# Altium schematic sheet Power.SchDoc
size 420 x 297 mm; SheetNumber: 3; SheetTotal: 11
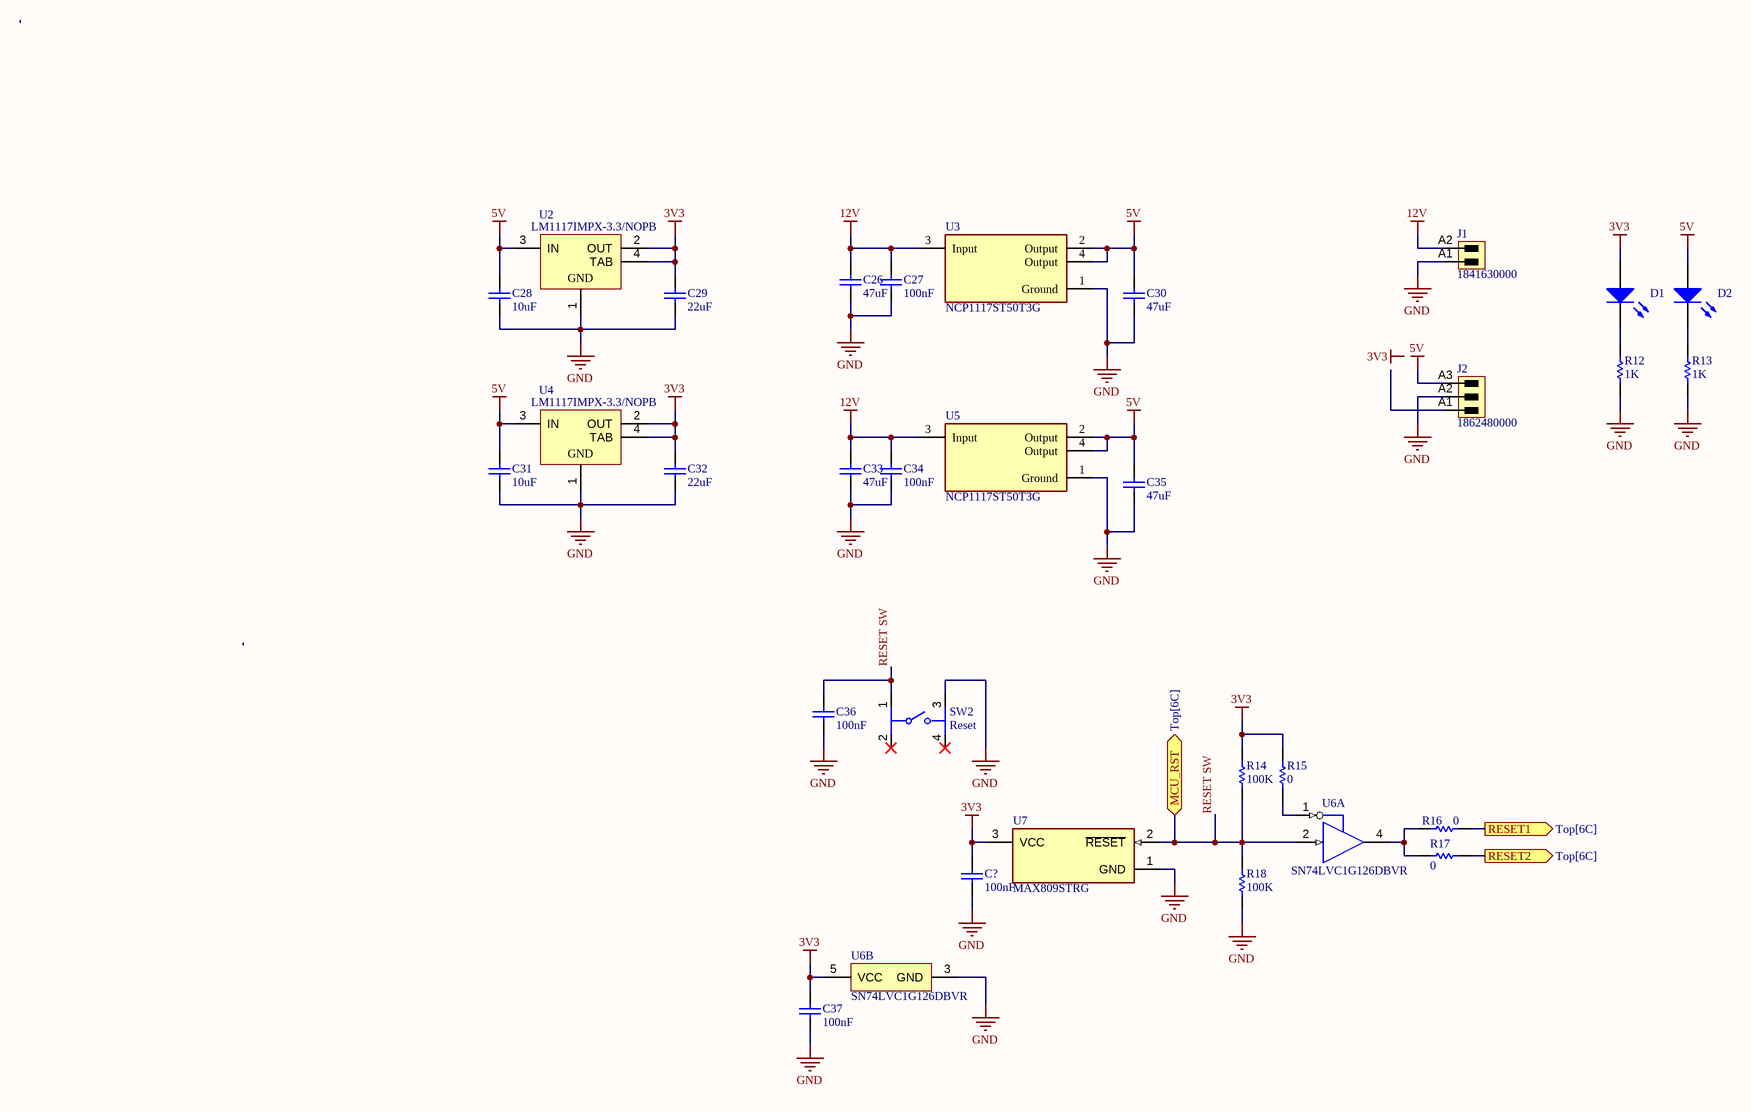
[diagram p0: Power.SchDoc]

## Parts
C26  value 47uF  (hidden comment: Capacitor)
C27  value 100nF  (hidden comment: Capacitor)
C28  value 10uF  (hidden comment: Capacitor)
C29  value 22uF  (hidden comment: Capacitor)
C30  value 47uF  (hidden comment: Capacitor)
C31  value 10uF  (hidden comment: Capacitor)
C32  value 22uF  (hidden comment: Capacitor)
C33  value 47uF  (hidden comment: Capacitor)
C34  value 100nF  (hidden comment: Capacitor)
C35  value 47uF  (hidden comment: Capacitor)
C36  value 100nF  (hidden comment: Capacitor)
C37  value 100nF  (hidden comment: Capacitor)
C?  value 100nF  (hidden comment: Capacitor)
D1  Light-Emitting Diode  (value not drawn)
D2  Light-Emitting Diode  (value not drawn)
J1  1841630000  [SL_SMT_3_5_90G_02]
J2  1862480000  [SC_SMT_3_81_90G_03]
R12  value 1K  (hidden comment: Resistor)
R13  value 1K  (hidden comment: Resistor)
R14  value 100K  (hidden comment: Resistor)
R15  value 0  (hidden comment: Resistor)
R16  value 0  (hidden comment: Resistor)
R17  value 0  (hidden comment: Resistor)
R18  value 100K  (hidden comment: Resistor)
SW2  Reset  [FP-PTS526SK15SMTR2LFS-MFG]
U2  LM1117IMPX-3.3/NOPB  [MP04A_M]
U3  NCP1117ST50T3G  [FP-318H-MFG]
U4  LM1117IMPX-3.3/NOPB  [MP04A_M]
U5  NCP1117ST50T3G  [FP-318H-MFG]
U6  SN74LVC1G126DBVR  [DBV0005A_L]  (parts A,B of 2)
U7  MAX809STRG  [FP-318-08-MFG]

## Ports
MCU_RST (bidir, see Top[6C]), RESET1 (out, see Top[6C]), RESET2 (out, see Top[6C])

## Nets
3V3: C29.2 C32.2 C37.1 C?.1 D1.1(A) R14.1 R15.1 U2.2(OUT) U2.4(TAB) U4.2(OUT) U4.4(TAB) U6.5(VCC) U7.3(VCC)
5V: C28.2 C30.2 C31.2 C35.2 D2.1(A) J2.A3 U2.3(IN) U3.2(Output) U3.4(Output) U4.3(IN) U5.2(Output) U5.4(Output)
12V: C26.2 C27.2 C33.2 C34.2 J1.A2 U3.3(Input) U5.3(Input)
GND: C26.1 C27.1 C28.1 C29.1 C30.1 C31.1 C32.1 C33.1 C34.1 C35.1 C36.2 C37.2 C?.2 J1.A1 J2.A2 R12.2 R13.2 R18.2 SW2.3 U2.1(GND) U3.1(Ground) U4.1(GND) U5.1(Ground) U6.3(GND) U7.1(GND)
RESET1: R16.1 ; port RESET1
RESET2: R17.2 ; port RESET2
RESET SW: C36.1 R14.2 R18.1 SW2.1 U6.2(A) U7.2(~{RESET}) ; port MCU_RST
NetD1_2: D1.2(K) R12.1
NetD2_2: D2.2(K) R13.1
NetR15_2: R15.2 U6.1(OE)
NetR16_2: R16.2 R17.1 U6.4(Y)

Not connected (* = marked no-connect by the designer): J2 A1; SW2 2* 4*

## Notes on the sheet
- Labels drawn without touching a wire or pin: 3V3
- THIS DOCUMENT AND THE DATA DISCLOSED HEREIN OR
- HEREWITH IS THE PROPERTY OF ALTIUM LIMITED AND MAY
- DWG NO:
- REVISION
- REV:
- DESCRIPTION
- DATE
- APPROVED
- BE FREELY DISTRIBUTED IN WHOLE. NO RIGHTS ARE
- RESERVED OR EXPRESS OR IMPLIED WARANTEE GIVEN.
- ENG:
- APPROVALS
- PROJECT
- DSN:
- CHK:
- REFERENCE DOCUMENTS
- PROJECT REVISION:
- TITLE
- DOCUMENT REVISION:
- DESIGN ITEM:
- BOM:
- FAB DWG:
- PCB DWG:
- ASSY DWG:
- SCALE:
- A3
- SIZE
- CAGE CODE
- FILE NAME
- DWG NO.
- SHEET
- OF
- REV

## Library data of the parts
C26-C37 C? = Capacitor: SimulationGenericComponent: True
  C36 C37 C?: Supplier 1: Arrow Electronics
D1 D2 = LED: AF: 1; BV: 0; BV_MAX: 1e99; EG: 1.11; FC: 0.5; IBV: 0.001; IS: 1e-14; MJSW: 0.33; NTUN: 30; TNOM: 27; XTI: 3; SimulationGenericComponent: True; CJO: 0; CJP: 0; CTA: 0; CTP: 0; FCS: 0.5; FV_MAX: 1e99; IKF: 0; IKR: 0; ISR: 1e-14; JSW: 0; JTUN: 0; JTUNSW: 0; KEG: 1; KF: 0; LEVEL: 1; N: 1; NBV: 1; NR: 1; NS: 1; PHP: 1; RS: 0; TCV: 0; TLEV: 0; TLEVC: 0; TM1: 0; TM2: 0; TPB: 0; TPHP: 0; TRS: 0; TRS2: 0; TT: 0; TTT1: 0; TTT2: 0; VJ: 1; XTITUN: 3
J1 = CMP-1559-01184-1: OMNIMATE Signal - series BL/SL 3.50; Manufacturer: Weidmueller; Rated_voltage_use_group_B_UL_1059: 300 V; Mounting_onto_the_PCB: Reflow solder connection; Rated_current_min_no_of_poles_TU_20_deg_C: 15 A; Pitch_mm: 3.5 mm; Insulating_material: LCP GF; Pitch_inch: 0.138 inch; Rated_voltage_for_surge_voltage_class_pollution_degree_II_2: 320 V; Short_text_for_material: SL-SMT 3.50/02/90G 3.2SN BK BX; No_of_poles: 2; Contact_surface: tinned; Side_termination_characteristic: closed side; Rated_current_use_group_B_UL_1059: 10 A; UL_94_flammability_rating: V-0; Outgoing_elbow: 90°; Solder_pin_length_mm: 3.2 mm; Revision: V1; Qty: 100 PCS; ComponentLink2URL: http://catalog.weidmueller.com/catalog/Start.do?localeId=en&ObjectID=1841630000; Packaging: Box; Colour: Black; PackageReference: SL_SMT_3_5_90G_02; PartNumber: 1841630000; ComponentLink1Description: Manufacturer URL; ComponentLink1URL: http://www.weidmueller.com/; ComponentLink2Description: URL Link1
J2 = CMP-1559-00516-1: OMNIMATE Signal - series BC/SC 3.81; Manufacturer: Weidmueller; Rated_current_use_group_B_UL_1059: 10 A; Rated_voltage_for_surge_voltage_class_pollution_degree_II_2: 320 V; Contact_surface: tinned; Outgoing_elbow: 90°; Rated_voltage_use_group_B_UL_1059: 300 V; Solder_pin_length_mm: 3.2 mm; UL_94_flammability_rating: V-0; Rated_current_min_no_of_poles_TU_20_deg_C: 19 A; Insulating_material: LCP GF; Mounting_onto_the_PCB: Reflow solder connection; No_of_poles: 3; Short_text_for_material: SC-SMT 3.81/03/90G 3.2SN BK BX; Contact_material: Cu-Leg; Pitch_inch: 0.15 inch; Side_termination_characteristic: closed side; Pitch_mm: 3.81 mm; Revision: V1; ComponentLink1URL: http://www.weidmueller.com/; ComponentLink2Description: URL Link1; ComponentLink1Description: Manufacturer URL; Colour: Black; ComponentLink2URL: http://catalog.weidmueller.com/catalog/Start.do?localeId=en&ObjectID=1862480000; PartNumber: 1862480000; Packaging: Box; PackageReference: SC_SMT_3_81_90G_03; Qty: 50 PCS
R12-R14 R18 = Resistor: TC1: 0; SimulationGenericComponent: True; TC2: 0
  R14 R18: Supplier 1: Digi-Key; Supplier Part Number 1: P0.0GCT-ND
R15-R17 = Resistor: SimulationGenericComponent: True; TC1: 0; TC2: 0; Supplier 1: Digi-Key; Supplier Part Number 1: P0.0GCT-ND
SW2 = CMP-10040-000013-1: TACT 5.2 X 5.2, 1.5 MM H, 260GF,; Manufacturer: C&K; Manufacturer Part Number: PTS526SK15SMTR2LFS; Operating Force: 250gf; Throw Configuration: SPST-NO; Contact Current Rating: 50mA; Standoff Height: 0mm; Contact Resistance: 100mΩ; Voltage Rating Dc: 12V; Electromechanical Life: 200000Cycles; Device Class L3: Tactile Switches; Device Class L2: Switches; Temperature: -20°C to +70°C; Temperature Range Low: -20°C; Package: PTS526SK15SMTR2LFS; Temperature Range High: +70°C; ComponentLink2Description: Datasheet; Device Class L1: Electromechanical; Height: 1.65mm; Digikey Description: TACT 5.2 X 5.2, 1.5 MM H, 260GF,; Category: Switch; RoHS: TRUE; Automotive: No; Lead Free: Yes; Octopart: https://octopart.com/pts526+sk15+smtr2+lfs-c%26k+components-100617999; ComponentLink2URL: https://www.ckswitches.com/media/2780/pts526.pdf
U2 U4 = CMP-0062-01632-3: 800mA Low-Dropout Linear Regulator, 4-pin SOT-223, Pb-Free; Manufacturer: National Semiconductor; CompType: LDO IC; PackageTopMarking: XYTT*N05B; High-Reliability: Y; PowerWise: N; ComponentLink3Description: LM1117 Web Page; Code_JEDEC: TO-261-AA; RoHS: Y; PackageReference: MP04A; ComponentLink3URL: http://www.national.com/pf/LM/LM1117.html; RevisionNote: SCH symbol layout adjusted; ComponentLink2URL: http://www.national.com/ds/LM/LM1117.pdf; ComponentLink2Description: LM1117 Datasheet; ComponentLink1Description: Manufacturer URL; ComponentLink4Description: MP04A Package Page; ComponentLink4URL: http://www.national.com/packaging/folders/mp04a.html; PackageVersion: revB, Apr-2003; DatasheetVersion: Apr-2006; PackageDescription: Molded SOT-223, 6.50 x 3.56 x 1.6mm Body, 4 Lead, 2.3mm Pitch; Code_IPC: SOT223-4; ComponentLink1URL: http://www.national.com/; PinCount: 4; PartNumber: LM1117IMPX-3.3/NOPB
U3 U5 = CMP-0592-00001-4: IC REG LINEAR 5V 1A SOT223; Output Voltage Accuracy: 1%; Number of Outputs: 1; Dropout Voltage: 1.2V; Polarity: Positive; Power Rating: 781mW; Input Bias Current: 6mA; Quiescent Current: 10mA; Output Type: Fixed; Max Input Voltage: 20V; Min Input Voltage: 3.5V; Max Operating Temperature: 125°C; Number of Pins: 4; Case/Package: SOT-223; Min Operating Temperature: 0°C; Accuracy: 1%; Contact Plating: Tin; Min Current Limit: 1A; Output Current: 1A; Max Output Current: 1A; Length: 6.7mm; Packaging: Tape and Reel; Package Quantity: 1; Height: 1.69mm; REACH SVHC: No SVHC; Width: 3.7mm; Halogen Free: Halogen Free; RoHS Compliant: Yes; Nominal Output Voltage: 5V; Lead Free: Lead Free; Radiation Hardening: No; Tolerance: 1%; Number of Regulators: 1; Output Voltage: 5V
U6 = CMP-0859-00036-3: Single Bus Buffer Gate With 3-State Outputs, DBV0005A, LARGE T&R; Manufacturer: Texas Instruments; Bits(#): 1; Sub-Family: Non-Inverting Buffer/Driver; F @ Nom Voltage(Max)(Mhz): 150; VCC(Min)(V): 1.65; Input Type: CMOS/TTL; Voltage(Nom)(V): 1.8,2.5,3.3,5; Output Type: CMOS; ICC @ Nom Voltage(Max)(mA): 0.01; Technology Family: LVC; Logic: True; VCC(Max)(V): 5.5; Schmitt Trigger: No; 3-State Output: Yes; tpd @ Nom Voltage(Max)(ns): 8,5.5,4.5,4; Rating: Catalog; Output Drive (IOL/IOH)(Max)(mA): 32/-32; DatasheetVersion: SCES224R; Operating Temperature Range(C): -40 to 125,-40 to 85; PackageReference: DBV0005A; Generic Part Number: SN74LVC1G126
U7 = CMP-07130-000007-1: IC MPU SUPERVISORY 2.93V SOT23; Manufacturer: ON SEMICONDUCTOR; Number Of Outputs: 1; Nominal Supply Current: 0.5-0.8uA; Min Supply Voltage: 1V; Max Junction Temp: +125°C; Max Supply Voltage: 5.5V; Reset Timeout: 10us; Output Current: 20mA; Output Voltage: 0.3V; Reset Type: Active Low; Standoff Height: 0.01mm; Octopart: https://octopart.com/max809strg-on+semiconductor-509853; Category: IC; Temperature: -40°C to +125°C; Temperature Range Low: -40°C; ComponentLink2URL: https://www.onsemi.cn/PowerSolutions/document/MAX809S-D.PDF; Device Class L1: Integrated Circuits (ICs); Automotive: No; Package: 318-08; Device Class L2: Power Management ICs; RoHS: TRUE; Height: 1.11mm; Digikey Description: IC MPU SUPERVISORY 2.93V SOT23; Mouser Description: Supervisory Circuits 2.93V uP Reset; ComponentLink2Description: Datasheet; Manufacturer Part Number: MAX809STRG; Temperature Range High: +125°C; Number Of Rails Monitored: 1; Threshold Voltage: 2.93V; Footprint Url: https://www.onsemi.com/pub/Collateral/318-08.PDF; Device Class L3: Voltage Supervisors; Lead Free: Yes